# EAGLE design driverMotor (EAGLE 9.6.2)
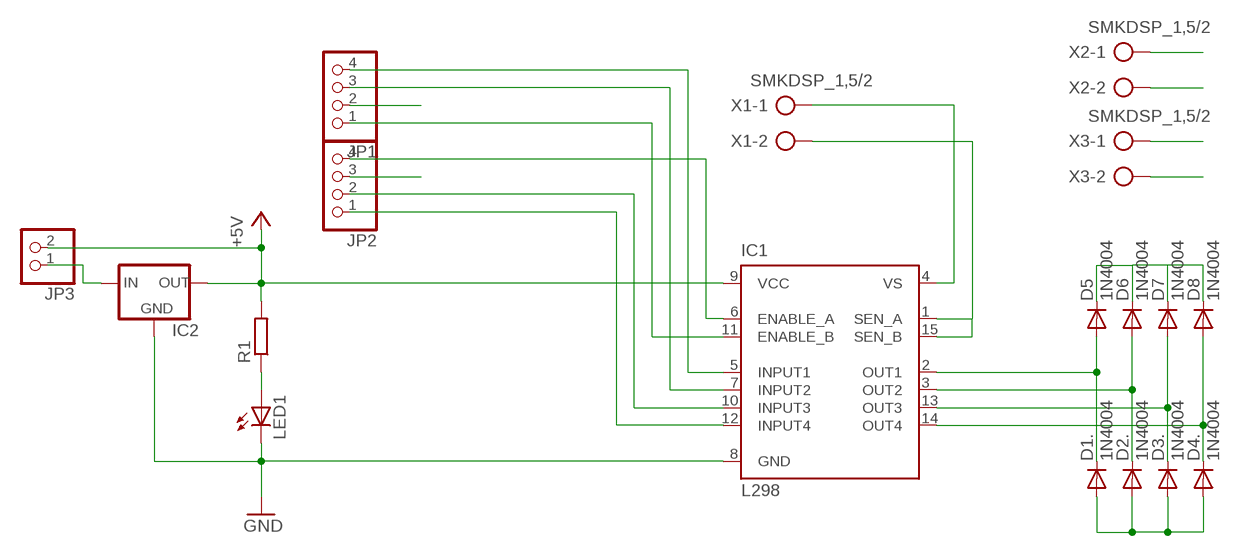
[diagram p0: schematic, sheet 1]

## Parts
D1.  1N4004  [DO41-10]
D2.  1N4004  [DO41-10]
D3.  1N4004  [DO41-10]
D4.  1N4004  [DO41-10]
D5  1N4004  [DO41-10]
D6  1N4004  [DO41-10]
D7  1N4004  [DO41-10]
D8  1N4004  [DO41-10]
IC1  L298  [MULTIWATT-15]
IC2  78MXXS  [78MXXS]
JP1  PINHD-1X4  [1X04]
JP2  PINHD-1X4  [1X04]
JP3  PINHD-1X2  [1X02]
LED1  LED5MM  [LED5MM]
R1  R-EU_0411/12  [0411/12]
X1  SMKDSP_1,5/2  [SMKDSP_1,5/2]
X2  SMKDSP_1,5/2  [SMKDSP_1,5/2]
X3  SMKDSP_1,5/2  [SMKDSP_1,5/2]

## Nets
+5V: IC1.9(VCC) IC2.OUT JP1.2 JP3.2 R1.2
ENABLE_A: IC1.6(ENABLE_A) JP2.4
ENABLE_B: IC1.11(ENABLE_B) JP1.1
GND: D1..A D2..A D3..A D4..A IC1.1(SEN_A) IC1.8(GND) IC1.15(SEN_B) IC2.GND JP2.3 LED1.K(C) X1.2
INPUT1: IC1.5(INPUT1) JP1.4
INPUT2: IC1.7(INPUT2) JP1.3
INPUT3: IC1.10(INPUT3) JP2.2
INPUT4: IC1.12(INPUT4) JP2.1
LED: LED1.A R1.1
MOTOR1_1: D1..C D5.A IC1.2(OUT1) X2.1
MOTOR1_2: D2..C D6.A IC1.3(OUT2) X2.2
MOTOR2_1: D3..C D7.A IC1.13(OUT3) X3.1
MOTOR2_2: D4..C D8.A IC1.14(OUT4) X3.2
N$1: IC2.IN JP3.1
VS: D5.C D6.C D7.C D8.C IC1.4(VS) X1.1

## Library data of the parts
D1. D2. D3. D4. D5-D8 = diode:1N4004: DIODE general purpose rectifier, 1 A
IC1 = st-microelectronics:L298: DUAL FULL-BRIDGE DRIVER
IC2 = v-reg:78MXXS: VOLTAGE REGULATOR
JP1 JP2 = pinhead:PINHD-1X4: PIN HEADER
JP3 = pinhead:PINHD-1X2: PIN HEADER
LED1 = led:LED: LED OSRAM: - CHIPLED LG R971, LG N971, LY N971, LG Q971, LY Q971, LO R971, LY R971 LH N974, LH R974 LS Q976, LO Q976, LY Q976 LO Q996 - Hyper CHIPLED LW Q18S LB Q993, LB Q99A, LB R99A - SideLED LS A670, LO A670, LY A670, LG A670, LP A670 LB A673, LV A673, LT A673, LW A673 LH A674 LY A675 LS A676, LA A676, LO A676, LY A676, LW A676 LS A679, LY A679, LG A679 - Hyper Micro SIDELED® LS Y876, LA Y876, LO Y876, LY Y876 LT Y87S - SmartLED LW L88C, LW L88S LB L89C, LB L89S, LG L890 LS L89K, LO L89K, LY L89K LS L896, LA L896, LO L896, LY L896 - TOPLED LS T670, LO T670, LY T670, LG T670, LP T670 LSG T670, LSP T670, LSY T670, LOP T670, LYG T670 LG T671, LOG T671, LSG T671 LB T673, LV T673, LT T673, LW T673 LH T674 LS T676, LA T676, LO T676, LY T676, LB T676, LH T676, LSB T676, LW T676 LB T67C, LV T67C, LT T67C, LS T67K, LO T67K, LY T67K, LW E67C LS E67B, LA E67B, LO E67B, LY E67B, LB E67C, LV E67C, LT E67C LW T67C LS T679, LY T679, LG T679 LS T770, LO T770, LY T770, LG T770, LP T770 LB T773, LV T773, LT T773, LW T773 LH T774 LS E675, LA E675, LY E675, LS T675 LS T776, LA T776, LO T776, LY T776, LB T776 LHGB T686 LT T68C, LB T68C - Hyper Mini TOPLED® LB M676 - Mini TOPLED Santana® LG M470 LS M47K, LO M47K, LY M47K Source: http://www.osram.convergy.de LUXEON: - LUMILED® LXK2-PW12-R00, LXK2-PW12-S00, LXK2-PW14-U00, LXK2-PW14-V00 LXK2-PM12-R00, LXK2-PM12-S00, LXK2-PM14-U00 LXK2-PE12-Q00, LXK2-PE12-R00, LXK2-PE12-S00, LXK2-PE14-T00, LXK2-PE14-U00 LXK2-PB12-K00, LXK2-PB12-L00, LXK2-PB12-M00, LXK2-PB14-N00, LXK2-PB14-P00, LXK2-PB14-Q00 LXK2-PR12-L00, LXK2-PR12-M00, LXK2-PR14-Q00, LXK2-PR14-R00 LXK2-PD12-Q00, LXK2-PD12-R00, LXK2-PD12-S00 LXK2-PH12-R00, LXK2-PH12-S00 LXK2-PL12-P00, LXK2-PL12-Q00, LXK2-PL12-R00 Source: www.luxeon.com KINGBRIGHT: KA-3528ASYC Source: www.kingbright.com
R1 = resistor:R-EU_: RESISTOR, European symbol
X1-X3 = con-phoenix-smkdsp:SMKDSP_1,5/2: Printklemme, Nennstrom: 17,5 A, Bemessungsspannung: 250 V, Raster: 5,0 mm Source: http://eshop.phoenixcontact.de .. 1733415.pdf; MF: FARNELL; MPN: 1733570; OC_FARNELL: 3041244; OC_NEWARK: 69C8588

## Board
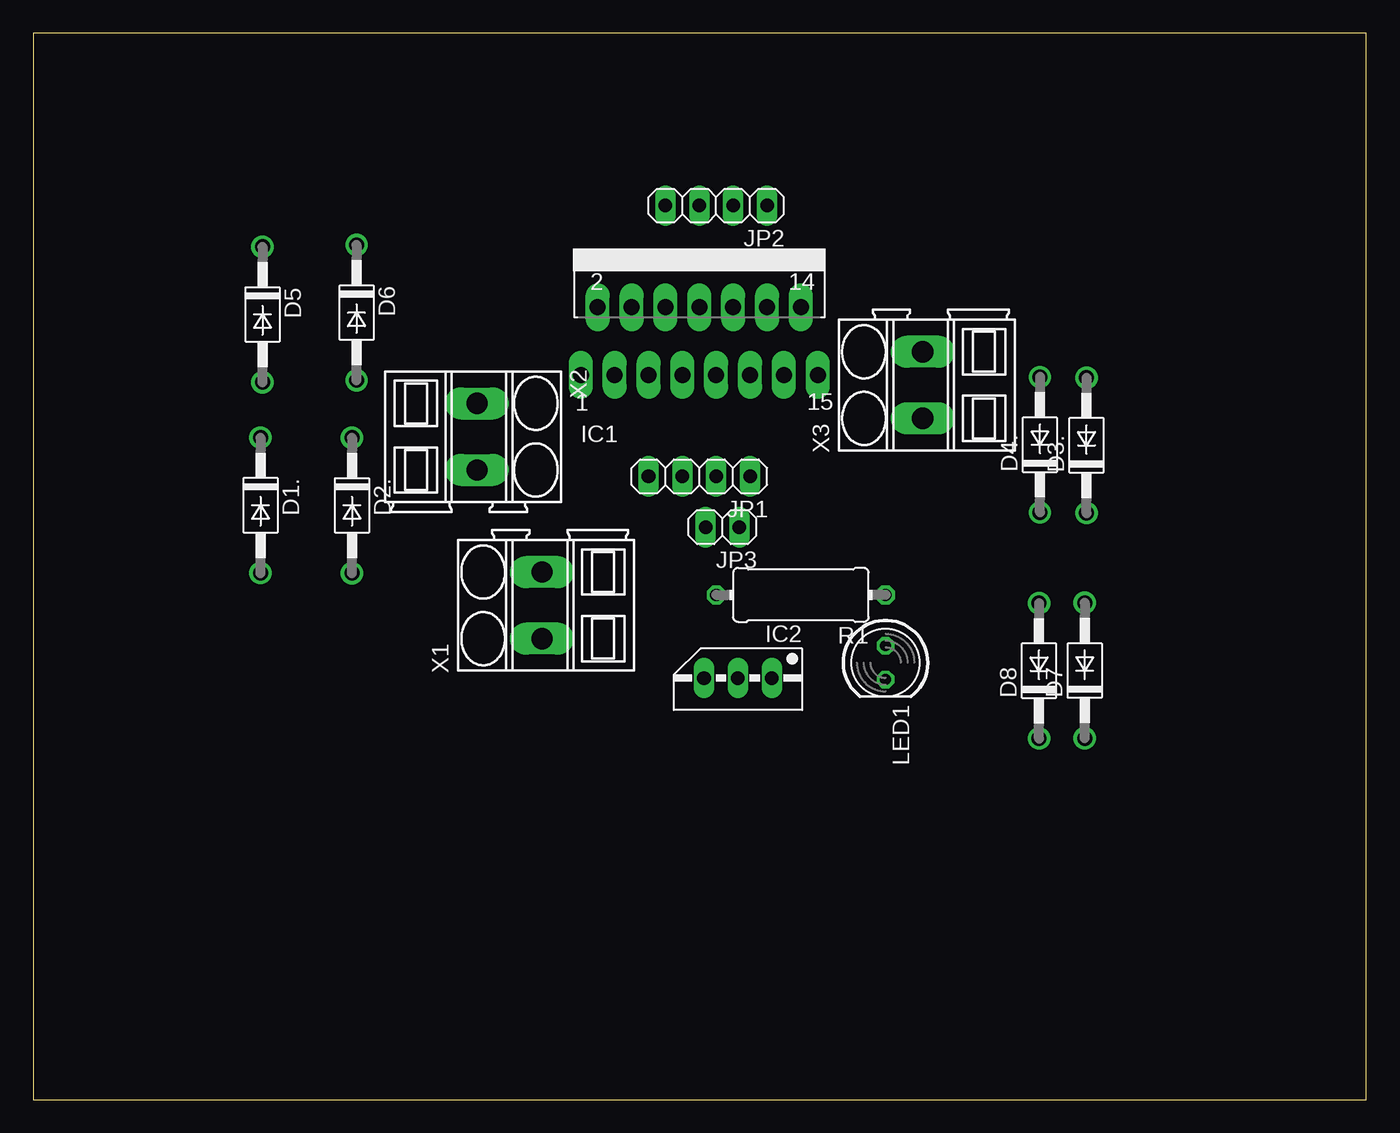
[diagram p1: board, top side]
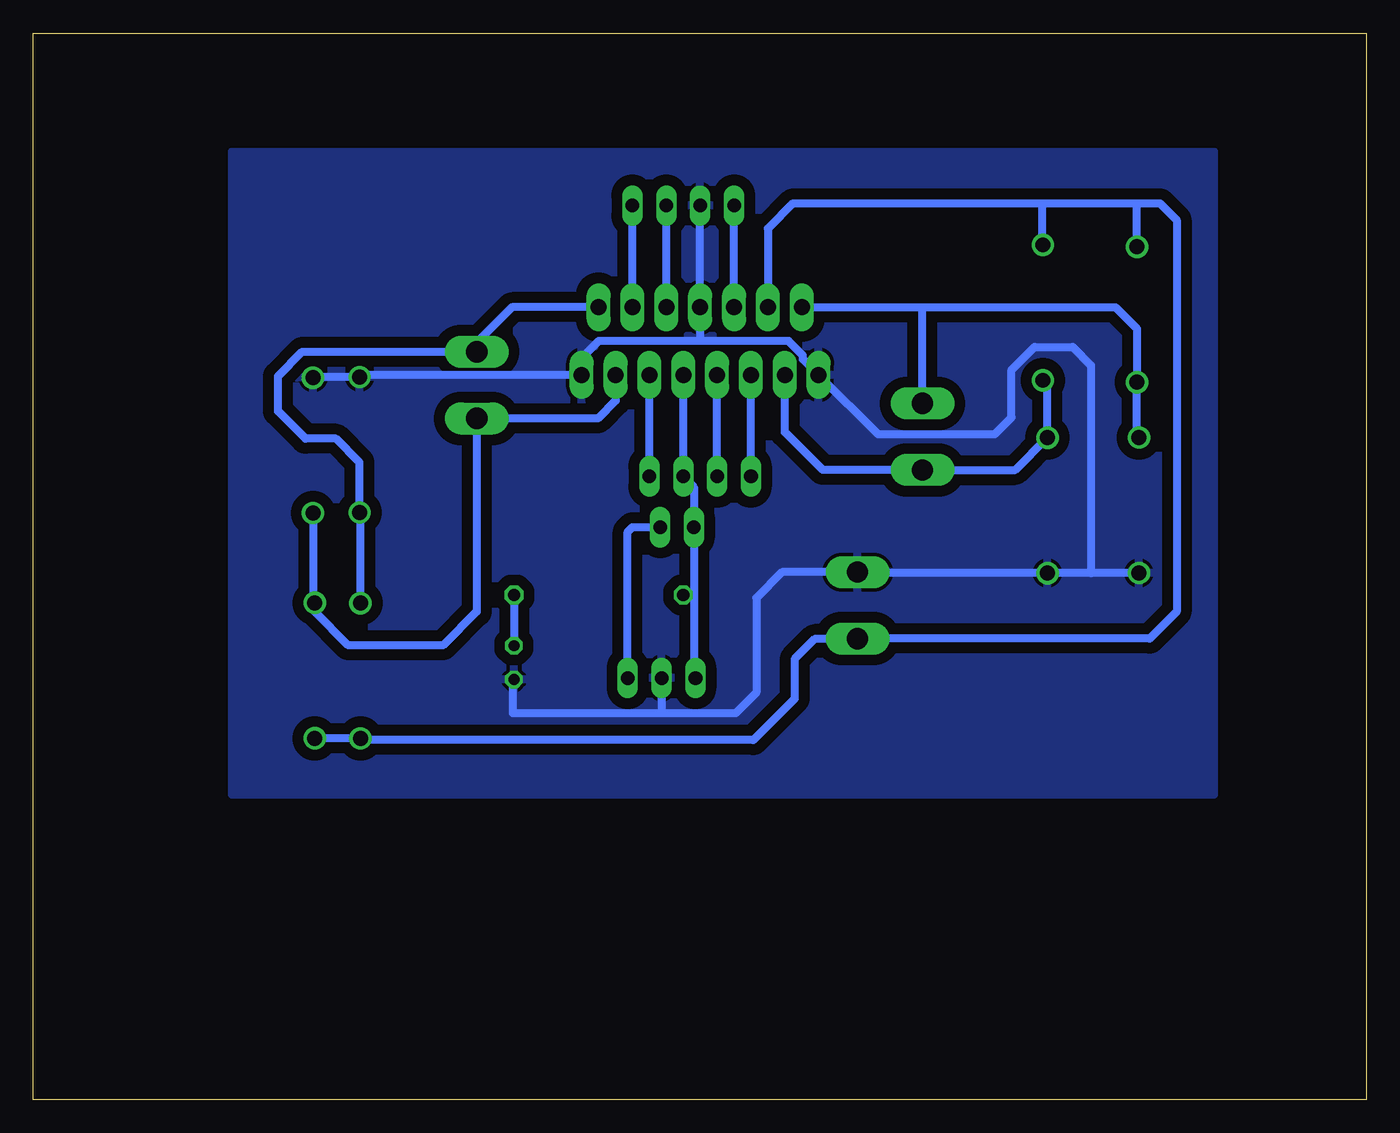
[diagram p2: board, bottom side, seen from below]

Size 100 x 80 mm. Coordinates in mm from the lower left corner, seen from the top.
Outline: 0,0 100,0 100,80 0,80 0,0
Copper layers (1*16): Top 0.035mm / dielectric 1.5mm / Bottom 0.035mm
Design rules "default": minimum track width 6mil, minimum drill 0.35mm, track to track 6mil, track to pad 6mil, pad to pad 6mil, via to via 6mil, smd to smd 6mil, copper to edge 40mil, drill to drill 6mil, minimum pad ring 10mil, minimum via ring 8mil, stop-mask expansion 4mil, vias tented up to drill 0mil, thermal gap 10mil

### Footprints (pad centres in the part's own frame; a part is rotated, then mirrored left to right if it is on the bottom)
DO41-10 = drill 1.118: A 5.08,0; C -5.08,0
MULTIWATT-15 = drill 1.2 long: 1 -8.89,-7.62; 2 -7.62,-2.54; 3 -6.35,-7.62; 4 -5.08,-2.54; 5 -3.81,-7.62; 6 -2.54,-2.54; 7 -1.27,-7.62; 8 0,-2.54; 9 1.27,-7.62; 10 2.54,-2.54; 11 3.81,-7.62; 12 5.08,-2.54; 13 6.35,-7.62; 14 7.62,-2.54; 15 8.89,-7.62
78MXXS = drill 1.016 long: GND 0,-2.54; IN -2.54,-2.54; OUT 2.54,-2.54
1X04 = drill 1.016 long: 1 -3.81,0; 2 -1.27,0; 3 1.27,0; 4 3.81,0
1X02 = drill 1.016 long: 1 -1.27,0; 2 1.27,0
LED5MM = drill 0.813 octagon: A -1.27,0; K 1.27,0
0411/12 = drill 0.914 octagon: 1 -6.35,0; 2 6.35,0
SMKDSP_1,5/2 = drill 1.6 pad 1.8 long: 1 -2.5,0; 2 2.5,0

### Placement (x,y rotation side)
D1.  17.05,44.58 270 top
D2.  23.91,44.58 270 top
D3.  79.01,49.08 90 top
D4.  75.52,49.13 90 top
D5  17.2,58.9 270 top
D6  24.25,59.04 270 top
D7  78.89,32.19 90 top
D8  75.45,32.17 90 top
IC1  49.97,61.99 0 top
IC2  52.86,29.09 180 top
JP1  49.97,46.75 180 top
JP2  51.24,67.07 180 top
JP3  51.7,42.94 180 top
LED1  63.94,32.78 270 top
R1  57.59,37.86 180 top
X1  38.17,37.08 90 top
X2  33.29,49.74 270 top
X3  66.73,53.6 90 top

### Tracks (layer width: path | path; a pad name or v marks a point on that pad's centre or on a via)
+5V
  Bottom 0.61: IC1.9 JP1.2 50.44,45.95 JP3.2 50.44,37.76 | 50.44,37.76 50.44,31.74 IC2.OUT | R1.2 51.13,37.76 50.44,37.76
ENABLE_A
  Bottom 0.61: IC1.6 JP2.4
ENABLE_B
  Bottom 0.61: JP1.1 IC1.11
GND
  Bottom 0.61: IC1.1 42.26,55.56 42.26,55.84 43.34,56.91 49.97,56.91 | 49.97,56.91 57.59,56.91 58.86,55.64 IC1.15 75.35,54.37 D4..A 78.97,54.21 D3..A | 49.97,56.91 IC1.8 JP2.3 | IC1.1 40.82,54.12 | 52.86,28.97 64.04,28.97 64.04,31.51 LED1.K | 52.86,30.36 IC2.GND 52.86,28.97 | D1..A 20.64,39.5 | 20.64,39.5 D2..A 38.09,39.5 X1.2 43.82,39.58 45.75,37.64 45.75,30.53 47.3,28.97 52.86,28.97 | IC1.1 36.62,49.92 27.86,49.92 26.6,51.18 26.6,54.74 24.88,56.46 22.02,56.46 20.64,55.09 20.64,39.5
  pour Bottom (isolate 0.813): 11.43,71.12 11.43,22.86 13.97,22.86 85.09,22.86 85.09,62.23 85.09,71.12
INPUT1
  Bottom 0.61: JP1.4 IC1.5
INPUT2
  Bottom 0.61: JP1.3 IC1.7
INPUT3
  Bottom 0.61: IC1.10 JP2.2
INPUT4
  Bottom 0.61: IC1.12 JP2.1
LED
  Bottom 0.61: R1.1 LED1.A
MOTOR1_1
  Bottom 0.61: IC1.2 33.25,59.45 | 33.25,59.45 18.81,59.45 17.2,57.84 D5.A | 17.2,53.48 D5.A | D1..C 17.2,49.81 D5.A | X2.1 33.29,59.42 33.25,59.45
MOTOR1_2
  Bottom 0.61: D6.A 23.91,53.62 D2..C 26.34,47.23 X2.2 40.77,47.23 43.62,50.08 IC1.3
MOTOR2_1
  Bottom 0.61: IC1.13 56.32,52.43 57.64,51.1 X3.1 | X3.1 66.81,51.18 | X3.1 66.73,36.61 69.26,34.08 76.37,34.08 78.89,36.6 78.89,36.95 | 78.89,36.95 D7.A | D3..C 79.01,37.08 78.89,36.95
MOTOR2_2
  Bottom 0.61: IC1.14 64.09,59.45 66.73,56.81 X3.2 79.82,56.1 81.64,54.28 81.64,51.64 79.58,49.58 77.28,49.58 75.52,47.81 D4..C 75.45,43.98 D8.A
N$1
  Bottom 0.61: JP3.1 55.05,42.94 55.4,42.59 IC2.IN
VS
  Bottom 0.61: 24.31,67.25 43,67.25 44.89,65.36 IC1.4 | D6.C 24.31,64.18 24.31,67.25 | 24.31,67.25 17.2,67.25 | 17.2,67.25 15.48,67.25 14.22,65.99 14.22,36.61 16.25,34.58 X1.1 38.2,34.54 41.39,34.54 42.88,33.05 42.88,30.06 45.98,26.97 75.33,26.97 D8.C 78.87,27.09 D7.C | D5.C 17.2,67.25